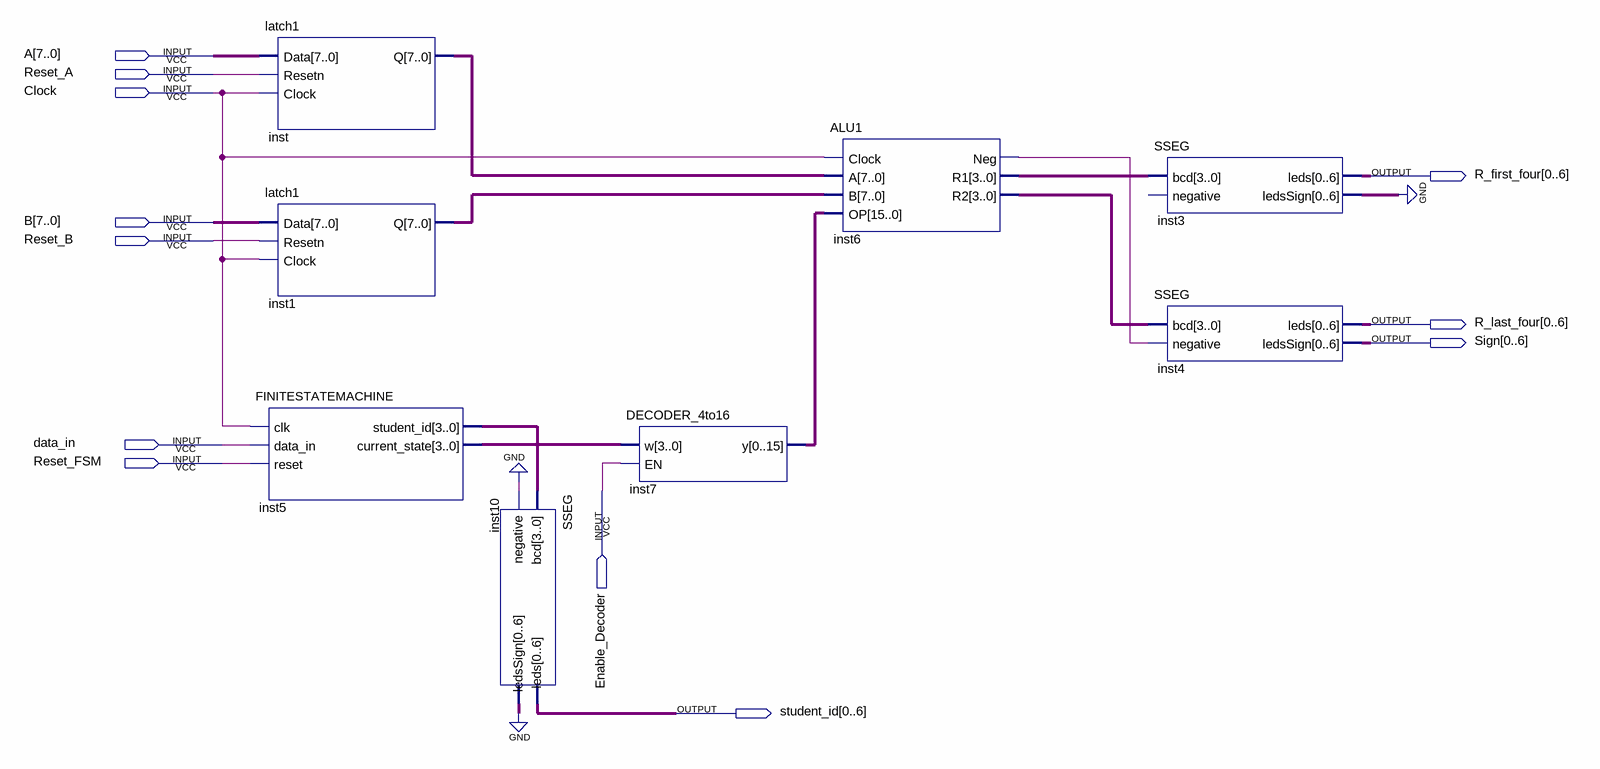
[diagram p0: schematic sheet]
// Quartus schematic Lab6.bdf as structural Verilog: 8 symbols, 12 pins
module Lab6 (
  input  [7:0] A,
  input  Reset_A,
  input  Clock,
  input  [7:0] B,
  input  Reset_B,
  input  data_in,
  input  Reset_FSM,
  input  Enable_Decoder,
  output [0:6] R_first_four,
  output [0:6] R_last_four,
  output [0:6] Sign,
  output [0:6] student_id
);

  wire inst6_neg;
  wire [3:0] inst5_current_state, inst5_student_id, inst6_r1, inst6_r2;
  wire [6:0] inst3_ledssign, inst10_ledssign;
  wire [7:0] inst1_q, inst_q;
  wire [15:0] inst7_y;

  latch1 inst (.Data(A), .Resetn(Reset_A), .Clock(Clock), .Q(inst_q));
  latch1 inst1 (.Data(B), .Resetn(Reset_B), .Clock(Clock), .Q(inst1_q));
  FINITESTATEMACHINE inst5 (
    .clk(Clock), .data_in(data_in), .reset(Reset_FSM), .student_id(inst5_student_id),
    .current_state(inst5_current_state));
  SSEG inst10 (.bcd(inst5_student_id), .negative(1'b0), .leds(student_id), .ledsSign(inst10_ledssign));
  DECODER_4to16 inst7 (.w(inst5_current_state), .EN(Enable_Decoder), .y(inst7_y));
  ALU1 inst6 (.Clock(Clock), .A(inst_q), .B(inst1_q), .OP(inst7_y), .Neg(inst6_neg), .R1(inst6_r1), .R2(inst6_r2));
  SSEG inst3 (.bcd(inst6_r1), .leds(R_first_four), .ledsSign(inst3_ledssign));  // open: negative
  SSEG inst4 (.bcd(inst6_r2), .negative(inst6_neg), .leds(R_last_four), .ledsSign(Sign));
  // also tied to GND on the sheet: {inst10_ledssign[0], inst10_ledssign[1], inst10_ledssign[2], inst10_ledssign[3], inst10_ledssign[4], inst10_ledssign[5], inst10_ledssign[6], inst3_ledssign[0], inst3_ledssign[1], inst3_ledssign[2], inst3_ledssign[3], inst3_ledssign[4], inst3_ledssign[5], inst3_ledssign[6]}
endmodule
